# Altium schematic sheet 4fader_Sub.SchDoc
size 381 x 241 mm; SheetNumber: 1; SheetTotal: 1
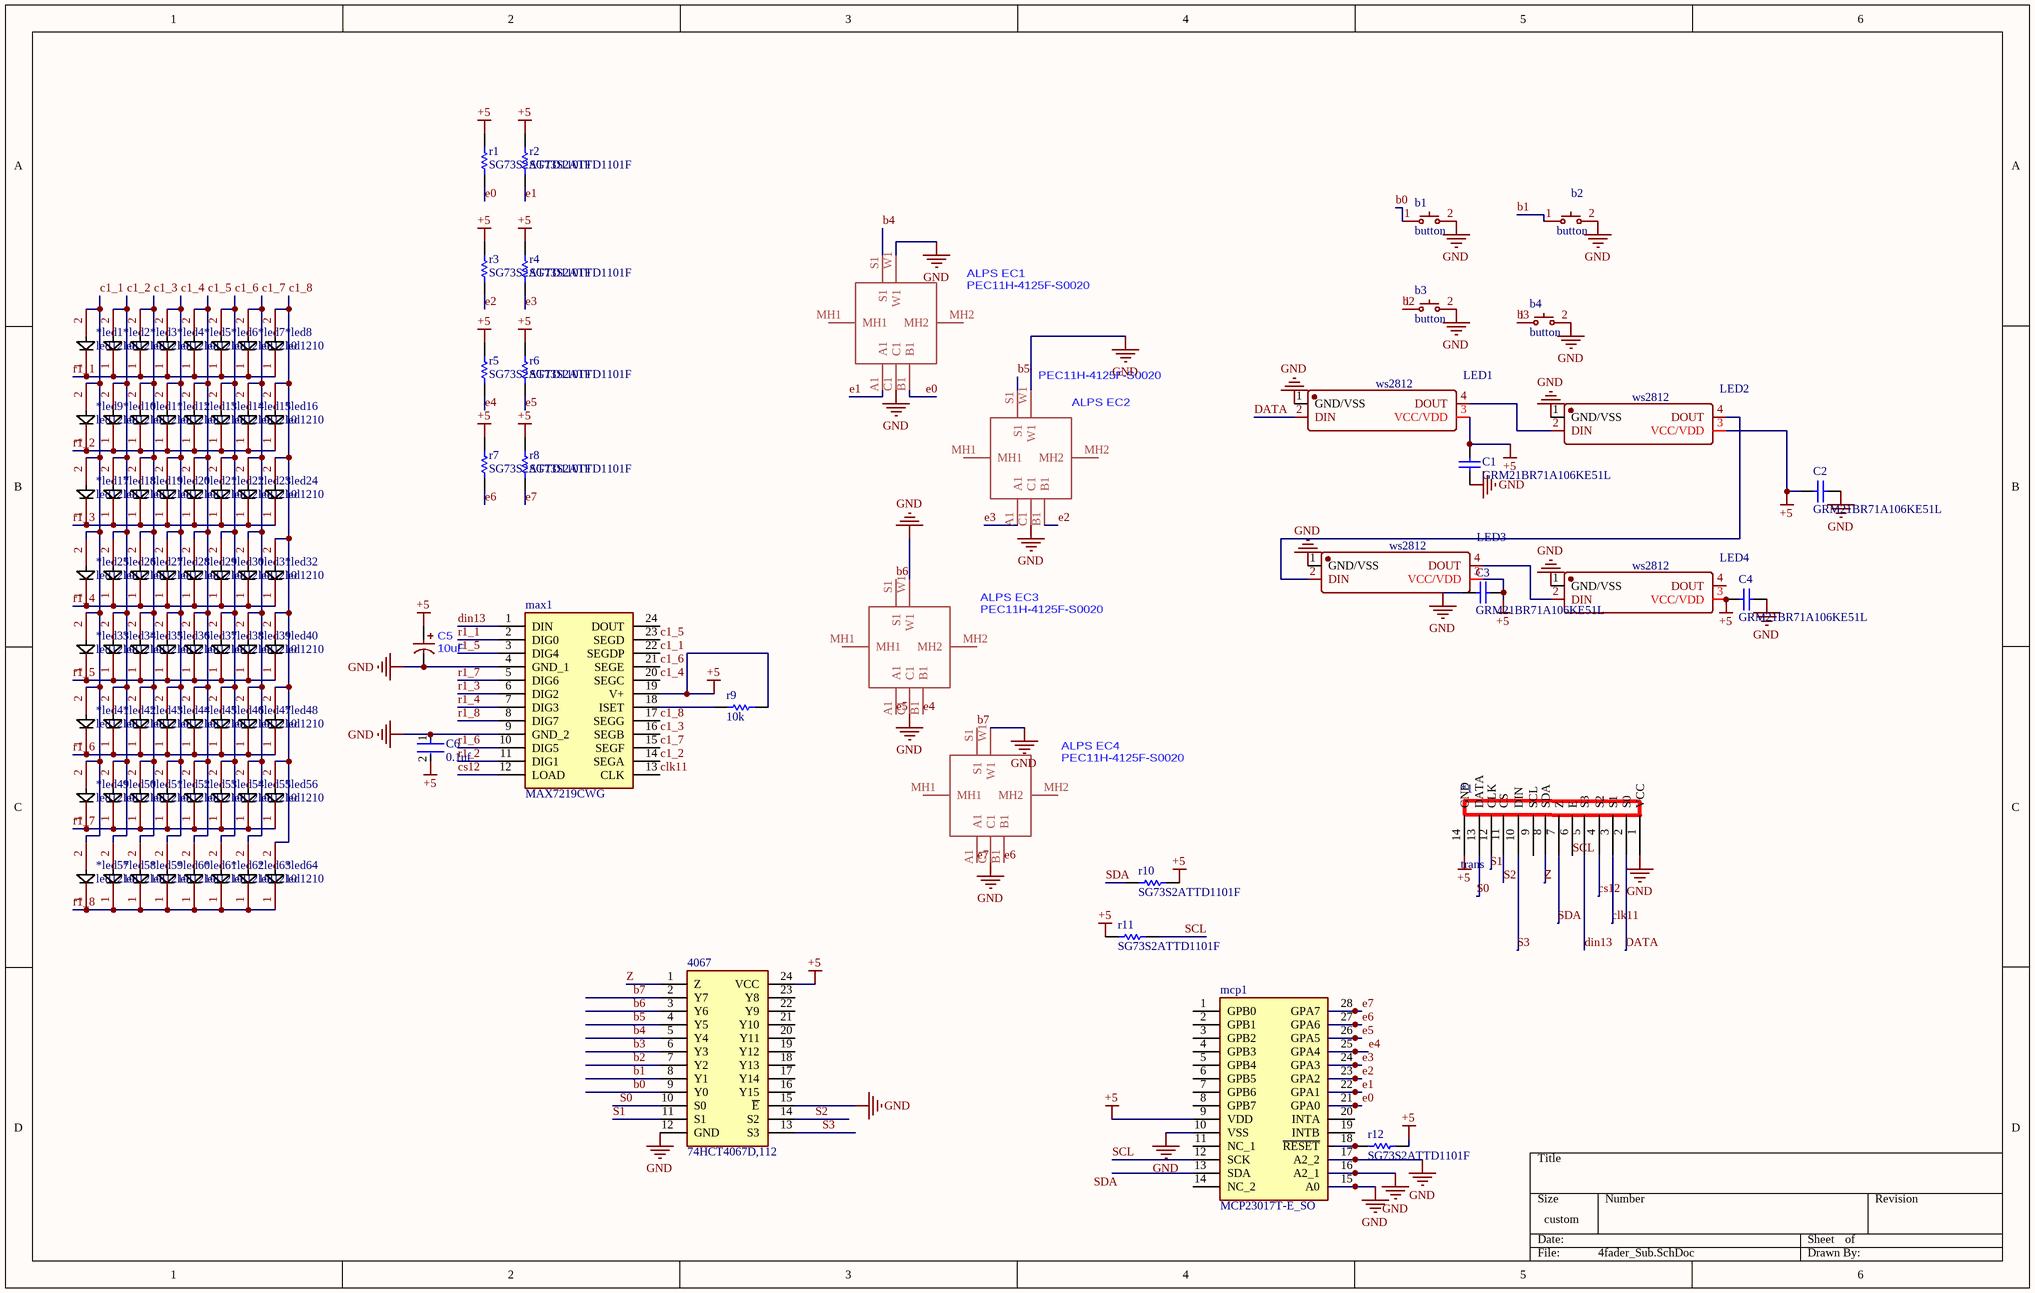
[diagram p0: 4fader_Sub.SchDoc]

## Parts
4067  74HCT4067D,112  [SOIC127P1032X265-24N]
*1  trans  [FPC-SMD_KH-FG1.0-H2.0-14PIN]
*led1  led1210  [1210贴片led]
*led2  led1210  [1210贴片led]
*led3  led1210  [1210贴片led]
*led4  led1210  [1210贴片led]
*led5  led1210  [1210贴片led]
*led6  led1210  [1210贴片led]
*led7  led1210  [1210贴片led]
*led8  led1210  [1210贴片led]
*led9  led1210  [1210贴片led]
*led10  led1210  [1210贴片led]
*led11  led1210  [1210贴片led]
*led12  led1210  [1210贴片led]
*led13  led1210  [1210贴片led]
*led14  led1210  [1210贴片led]
*led15  led1210  [1210贴片led]
*led16  led1210  [1210贴片led]
*led17  led1210  [1210贴片led]
*led18  led1210  [1210贴片led]
*led19  led1210  [1210贴片led]
*led20  led1210  [1210贴片led]
*led21  led1210  [1210贴片led]
*led22  led1210  [1210贴片led]
*led23  led1210  [1210贴片led]
*led24  led1210  [1210贴片led]
*led25  led1210  [1210贴片led]
*led26  led1210  [1210贴片led]
*led27  led1210  [1210贴片led]
*led28  led1210  [1210贴片led]
*led29  led1210  [1210贴片led]
*led30  led1210  [1210贴片led]
*led31  led1210  [1210贴片led]
*led32  led1210  [1210贴片led]
*led33  led1210  [1210贴片led]
*led34  led1210  [1210贴片led]
*led35  led1210  [1210贴片led]
*led36  led1210  [1210贴片led]
*led37  led1210  [1210贴片led]
*led38  led1210  [1210贴片led]
*led39  led1210  [1210贴片led]
*led40  led1210  [1210贴片led]
*led41  led1210  [1210贴片led]
*led42  led1210  [1210贴片led]
*led43  led1210  [1210贴片led]
*led44  led1210  [1210贴片led]
*led45  led1210  [1210贴片led]
*led46  led1210  [1210贴片led]
*led47  led1210  [1210贴片led]
*led48  led1210  [1210贴片led]
*led49  led1210  [1210贴片led]
*led50  led1210  [1210贴片led]
*led51  led1210  [1210贴片led]
*led52  led1210  [1210贴片led]
*led53  led1210  [1210贴片led]
*led54  led1210  [1210贴片led]
*led55  led1210  [1210贴片led]
*led56  led1210  [1210贴片led]
*led57  led1210  [1210贴片led]
*led58  led1210  [1210贴片led]
*led59  led1210  [1210贴片led]
*led60  led1210  [1210贴片led]
*led61  led1210  [1210贴片led]
*led62  led1210  [1210贴片led]
*led63  led1210  [1210贴片led]
*led64  led1210  [1210贴片led]
ALPS_EC1  PEC11H-4125F-S0020  [ALPS EC11]
ALPS_EC2  PEC11H-4125F-S0020  [ALPS EC11]
ALPS_EC3  PEC11H-4125F-S0020  [ALPS EC11]
ALPS_EC4  PEC11H-4125F-S0020  [ALPS EC11]
b1  button  [BUTTON]
b2  button  [BUTTON]
b3  button  [BUTTON]
b4  button  [BUTTON]
C1  GRM21BR71A106KE51L  [CAPC2013X140X45LL15T25]
C2  GRM21BR71A106KE51L  [CAPC2013X140X45LL15T25]
C3  GRM21BR71A106KE51L  [CAPC2013X140X45LL15T25]
C4  GRM21BR71A106KE51L  [CAPC2013X140X45LL15T25]
C5  10uF  [ELECTROLYTIC CAPACITOR SMD 4X5.4]
C6  0.1uf  [FP-CC0805-0_85-IPC_A]
LED1  ws2812  [ws2812]
LED2  ws2812  [ws2812]
LED3  ws2812  [ws2812]
LED4  ws2812  [ws2812]
max1  MAX7219CWG  [SOIC127P1032X265-24N]
mcp1  MCP23017T-E_SO  [SOIC127P1030X265-28N]
r1  SG73S2ATTD1101F  [RESC2013X60X30LL20T20]
r2  SG73S2ATTD1101F  [RESC2013X60X30LL20T20]
r3  SG73S2ATTD1101F  [RESC2013X60X30LL20T20]
r4  SG73S2ATTD1101F  [RESC2013X60X30LL20T20]
r5  SG73S2ATTD1101F  [RESC2013X60X30LL20T20]
r6  SG73S2ATTD1101F  [RESC2013X60X30LL20T20]
r7  SG73S2ATTD1101F  [RESC2013X60X30LL20T20]
r8  SG73S2ATTD1101F  [RESC2013X60X30LL20T20]
r9  10k  [RESC2013X60X30LL20T20]
r10  SG73S2ATTD1101F  [RESC2013X60X30LL20T20]
r11  SG73S2ATTD1101F  [RESC2013X60X30LL20T20]
r12  SG73S2ATTD1101F  [RESC2013X60X30LL20T20]

## Nets
+5: 4067.24(VCC) *1.14(GND) C1.2 C2.1 C3.2 C4.1 C5.1 C6.2 LED1.3(VCC/VDD) LED2.3(VCC/VDD) LED3.3(VCC/VDD) LED4.3(VCC/VDD) max1.19(V+) mcp1.9(VDD) r1.2 r2.2 r3.2 r4.2 r5.2 r6.2 r7.2 r8.2 r9.2 r10.2 r11.2 r12.2
GND: 4067.12(GND) 4067.15(~{E}) *1.1(VCC) ALPS_EC1.C1 ALPS_EC1.W1 ALPS_EC2.C1 ALPS_EC2.W1 ALPS_EC3.C1 ALPS_EC3.W1 ALPS_EC4.C1 ALPS_EC4.W1 b1.2 b2.2 b3.2 b4.2 C1.1 C2.2 C3.1 C4.2 C5.2 C6.1 LED1.1(GND/VSS) LED2.1(GND/VSS) LED3.1(GND/VSS) LED4.1(GND/VSS) max1.4(GND_1) max1.9(GND_2) mcp1.10(VSS) mcp1.15(A0) mcp1.16(A2_1) mcp1.17(A2_2)
b0: 4067.9(Y0) b1.1
b1: 4067.8(Y1) b2.1
b2: 4067.7(Y2) b3.1
b3: 4067.6(Y3) b4.1
b4: 4067.5(Y4) ALPS_EC1.S1
b5: 4067.4(Y5) ALPS_EC2.S1
b6: 4067.3(Y6) ALPS_EC3.S1
b7: 4067.2(Y7) ALPS_EC4.S1
c1_1: *led1.2 *led9.2 *led17.2 *led25.2 *led33.2 *led41.2 *led49.2 *led57.2 max1.22(SEGDP)
c1_2: *led2.2 *led10.2 *led18.2 *led26.2 *led34.2 *led42.2 *led50.2 *led58.2 max1.14(SEGA)
c1_3: *led3.2 *led11.2 *led19.2 *led27.2 *led35.2 *led43.2 *led51.2 *led59.2 max1.16(SEGB)
c1_4: *led4.2 *led12.2 *led20.2 *led28.2 *led36.2 *led44.2 *led52.2 *led60.2 max1.20(SEGC)
c1_5: *led5.2 *led13.2 *led21.2 *led29.2 *led37.2 *led45.2 *led53.2 *led61.2 max1.23(SEGD)
c1_6: *led6.2 *led14.2 *led22.2 *led30.2 *led38.2 *led46.2 *led54.2 *led62.2 max1.21(SEGE)
c1_7: *led7.2 *led15.2 *led23.2 *led31.2 *led39.2 *led47.2 *led55.2 *led63.2 max1.15(SEGF)
c1_8: *led8.2 *led16.2 *led24.2 *led32.2 *led40.2 *led48.2 *led56.2 *led64.2 max1.17(SEGG)
clk11: *1.3(S1) max1.13(CLK)
cs12: *1.4(S2) max1.12(LOAD)
DATA: *1.2(S0) LED1.2(DIN)
din13: *1.5(S3) max1.1(DIN)
e0: ALPS_EC1.B1 mcp1.21(GPA0) r1.1
e1: ALPS_EC1.A1 mcp1.22(GPA1) r2.1
e2: ALPS_EC2.B1 mcp1.23(GPA2) r3.1
e3: ALPS_EC2.A1 mcp1.24(GPA3) r4.1
e4: ALPS_EC3.B1 mcp1.25(GPA4) r5.1
e5: ALPS_EC3.A1 mcp1.26(GPA5) r6.1
e6: ALPS_EC4.B1 mcp1.27(GPA6) r7.1
e7: ALPS_EC4.A1 mcp1.28(GPA7) r8.1
r1_1: *led1.1 *led2.1 *led3.1 *led4.1 *led5.1 *led6.1 *led7.1 *led8.1 max1.2(DIG0)
r1_2: *led9.1 *led10.1 *led11.1 *led12.1 *led13.1 *led14.1 *led15.1 *led16.1 max1.11(DIG1)
r1_3: *led17.1 *led18.1 *led19.1 *led20.1 *led21.1 *led22.1 *led23.1 *led24.1 max1.6(DIG2)
r1_4: *led25.1 *led26.1 *led27.1 *led28.1 *led29.1 *led30.1 *led31.1 *led32.1 max1.7(DIG3)
r1_5: *led33.1 *led34.1 *led35.1 *led36.1 *led37.1 *led38.1 *led39.1 *led40.1 max1.3(DIG4)
r1_6: *led41.1 *led42.1 *led43.1 *led44.1 *led45.1 *led46.1 *led47.1 *led48.1 max1.10(DIG5)
r1_7: *led49.1 *led50.1 *led51.1 *led52.1 *led53.1 *led54.1 *led55.1 *led56.1 max1.5(DIG6)
r1_8: *led57.1 *led58.1 *led59.1 *led60.1 *led61.1 *led62.1 *led63.1 *led64.1 max1.8(DIG7)
S0: 4067.10(S0) *1.13(DATA)
S1: 4067.11(S1) *1.12(CLK)
S2: 4067.14(S2) *1.11(CS)
S3: 4067.13(S3) *1.10(DIN)
SCL: *1.6(E) mcp1.12(SCK) r11.1
SDA: *1.7(Z) mcp1.13(SDA) r10.1
Z: 4067.1(Z) *1.8(SDA)
NetLED1_4: LED1.4(DOUT) LED2.2(DIN)
NetLED2_4: LED2.4(DOUT) LED3.2(DIN)
NetLED3_4: LED3.4(DOUT) LED4.2(DIN)
Netmax1_18: max1.18(ISET) r9.1
Netmcp1_18: mcp1.18(~{RESET}) r12.1

Not connected (* = marked no-connect by the designer): 4067 16(Y15) 17(Y14) 18(Y13) 19(Y12) 20(Y11) 21(Y10) 22(Y9) 23(Y8); *1 9(SCL); ALPS_EC1 MH1 MH2; ALPS_EC2 MH1 MH2; ALPS_EC3 MH1 MH2; ALPS_EC4 MH1 MH2; LED4 4(DOUT); max1 24(DOUT); mcp1 1(GPB0) 2(GPB1) 3(GPB2) 4(GPB3) 5(GPB4) 6(GPB5) 7(GPB6) 8(GPB7) 11(NC_1) 14(NC_2) 19(INTB) 20(INTA)

## Library data of the parts
4067 = 74HCT4067D,112: Integrated Circuit; Manufacturer_Name: Nexperia; Datasheet Link: https://assets.nexperia.com/documents/data-sheet/74HC_HCT4067.pdf; Height: 2.65mm; Manufacturer_Part_Number: 74HCT4067D,112; Mouser Part Number: 771-74HCT4067D; Mouser Price/Stock: https://www.mouser.co.uk/ProductDetail/Nexperia/74HCT4067D112?qs=me8TqzrmIYUmedr29OWL5Q%3D%3D; Arrow Part Number: 74HCT4067D,112; Arrow Price/Stock: https://www.arrow.com/en/products/74hct4067d112/nexperia
C1-C4 = CMP-2007-03395-1: Manufacturer: Murata; Part Number: GRM21BR71A106KE51L
C5 = 4.3 X 4.3 ELECTROLYTIC  CAPACITOR SMD μF
C6 = CMP-1036-04410-2: CAP CER 0.1UF 25V X7R 0805; Manufacturer Part Number: CC0805KRX7R8BB104; Manufacturer: Yageo; Tolerance: 0.1; Material: Ceramic; Value: 100 nF; ComponentLink2URL: http://www.yageo.com/documents/recent/UPY-GPHC_Y5V_6.3V-to-50V_8.pdf; Category: Cap; Mouser Description: Multilayer Ceramic Capacitors MLCC - SMD/SMT 100nF 25V X7R 10%; Device Class L1: Passive Components; Footprint Url: http://www.yageo.com/exep/pages/download/literatures/UPY-C_GEN_24.pdf; Height: 0.95mm; Digikey Description: CAP CER 0.1UF 25V X7R 0805; Lead Free: Yes; Temperature Range High: +85°C; Temperature: -30°C to +85°C; Ipc Land Pattern Name: CAPC200125X85; Capacitance: 100 nF; Automotive: No; Octopart: https://octopart.com/cc0805krx7r8bb104-yageo-39467766; Device Class L2: Capacitors; Temperature Characteristic: X7R; Voltage Rating: 25 V; ComponentLink2Description: Datasheet; Temperature Range Low: -30°C; Device Class L3: Ceramic Capacitors; RoHS: TRUE; Package: CC0805-0.85
max1 = MAX7219CWG: Integrated Circuit; Manufacturer_Name: Analog Devices; Datasheet Link: http://datasheets.maximintegrated.com/en/ds/MAX7219-MAX7221.pdf; Height: 2.65mm; Manufacturer_Part_Number: MAX7219CWG; Mouser Part Number: 700-MAX7219CWG-NR; Mouser Price/Stock: https://www.mouser.co.uk/ProductDetail/Analog-Devices-Maxim-Integrated/MAX7219CWG?qs=p6VZ%252BklCkRRXY8S0D%252BcNmA%3D%3D
mcp1 = MCP23017T-E_SO: Integrated Circuit; Manufacturer_Name: Microchip; Manufacturer_Part_Number: MCP23017T-E/SO; Datasheet Link: http://ww1.microchip.com/downloads/en/DeviceDoc/20001952C.pdf; Height: 2.65mm; Mouser Part Number: 579-MCP23017T-E/SO; Mouser Price/Stock: https://www.mouser.co.uk/ProductDetail/Microchip-Technology/MCP23017T-E-SO?qs=usxtMOJb1RylPfT%252BJtgE3Q%3D%3D; Arrow Part Number: MCP23017T-E/SO; Arrow Price/Stock: https://www.arrow.com/en/products/mcp23017t-eso/microchip-technology?region=nac
r1-r8 r10-r12 = CMP-2001-02660-1: Manufacturer: KOA Speer; Part Number: SG73S2ATTD1101F
r9 = CMP-2001-02660-1: Manufacturer: KOA Speer; Part Number: SG73S2ATTD1101F